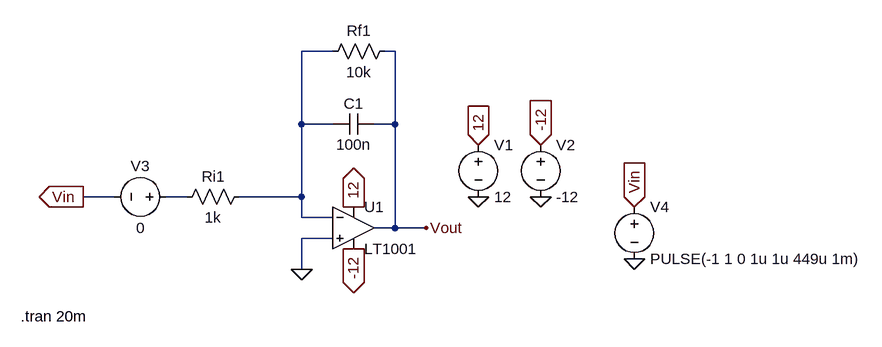
[diagram p0: schematic lab8.2.2.asc]
lab8.2.2.asc, the LTspice schematic file:
Version 4
SHEET 1 1064 680
WIRE 48 -48 0 -48
WIRE 144 -48 128 -48
WIRE 0 64 0 -48
WIRE 48 64 0 64
WIRE 144 64 144 -48
WIRE 144 64 112 64
WIRE -288 176 -336 176
WIRE -176 176 -208 176
WIRE 0 176 0 64
WIRE 0 176 -96 176
WIRE 0 208 0 176
WIRE 48 208 0 208
WIRE 144 224 144 64
WIRE 144 224 112 224
WIRE 192 224 144 224
WIRE 48 240 0 240
WIRE 0 288 0 240
FLAG 272 176 0
FLAG 368 176 0
FLAG 272 96 12
IOPIN 272 96 In
FLAG 80 192 12
IOPIN 80 192 Out
FLAG 368 96 -12
IOPIN 368 96 In
FLAG 80 256 -12
IOPIN 80 256 Out
FLAG 512 192 Vin
IOPIN 512 192 In
FLAG -336 176 Vin
IOPIN -336 176 Out
FLAG 192 224 Vout
FLAG 0 288 0
FLAG 512 272 0
SYMBOL voltage 272 80 R0
SYMATTR InstName V1
SYMATTR Value 12
SYMBOL voltage 368 80 R0
SYMATTR InstName V2
SYMATTR Value -12
SYMBOL res -80 160 R90
WINDOW 0 0 56 VBottom 2
WINDOW 3 32 56 VTop 2
SYMATTR InstName Ri1
SYMATTR Value 1k
SYMBOL cap 112 48 R90
WINDOW 0 0 32 VBottom 2
WINDOW 3 32 32 VTop 2
SYMATTR InstName C1
SYMATTR Value 100n
SYMBOL res 144 -64 R90
WINDOW 0 0 56 VBottom 2
WINDOW 3 32 56 VTop 2
SYMATTR InstName Rf1
SYMATTR Value 10k
SYMBOL voltage 512 176 R0
WINDOW 123 0 0 Left 0
WINDOW 39 0 0 Left 0
SYMATTR InstName V4
SYMATTR Value PULSE(-1 1 0 1u 1u 449u 1m)
SYMBOL voltage -192 176 R90
WINDOW 0 -32 56 VBottom 2
WINDOW 3 32 56 VTop 2
SYMATTR InstName V3
SYMATTR Value 0
SYMBOL Opamps\\LT1001 80 160 R0
SYMATTR InstName U1
TEXT -432 360 Left 2 !.tran 20m

The netlist it stands for:
* lab8.2.2.asc
V1 12 0 12
V2 -12 0 -12
Ri1 N001 N002 1k
C1 Vout N001 100n
Rf1 Vout N001 10k
V4 Vin 0 PULSE(-1 1 0 1u 1u 449u 1m)
V3 N002 Vin 0
XU1 0 N001 12 -12 Vout LT1001  ; pins In+ In- V+ V- OUT
.tran 20m
.lib LTC.lib
.backanno
.end